# Altium schematic sheet Horloge_Counter.SchDoc
size A4
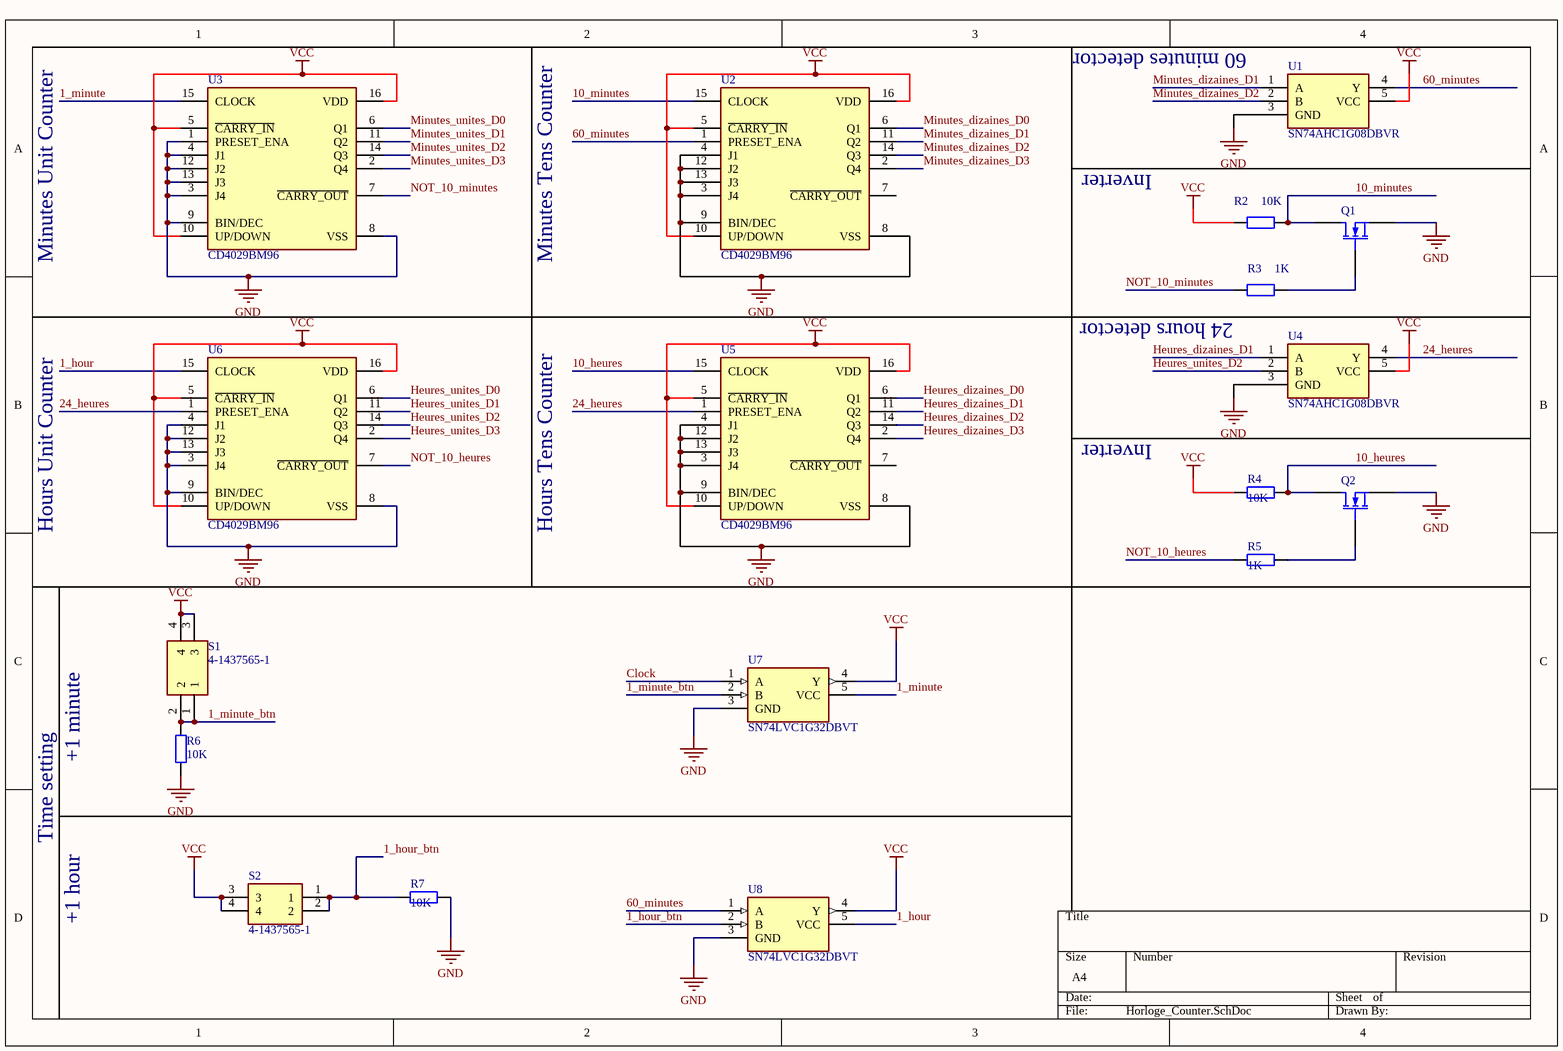
[diagram p0: Horloge_Counter.SchDoc]

## Parts
Q1  MOSFET-N  [SOT23_M]  (value not drawn)
Q2  MOSFET-N  [SOT23_M]  (value not drawn)
R2  value 10K  [Resistor 1206]  (hidden comment: Res2)
R3  value 1K  [Resistor 1206]  (hidden comment: Res2)
R4  value 10K  [Resistor 1206]  (hidden comment: Res2)
R5  value 1K  [Resistor 1206]  (hidden comment: Res2)
R6  value 10K  [Resistor 1206]  (hidden comment: Res2)
R7  value 10K  [Resistor 1206]  (hidden comment: Res2)
S1  4-1437565-1  [FSM-SWITCH]
S2  4-1437565-1  [FSM-SWITCH]
U1  SN74AHC1G08DBVR  [SOT95P280X145-5N]
U2  CD4029BM96  [SOIC127P600X175-16N]
U3  CD4029BM96  [SOIC127P600X175-16N]
U4  SN74AHC1G08DBVR  [SOT95P280X145-5N]
U5  CD4029BM96  [SOIC127P600X175-16N]
U6  CD4029BM96  [SOIC127P600X175-16N]
U7  SN74LVC1G32DBVT  [SOT95P280X145-5N]
U8  SN74LVC1G32DBVT  [SOT95P280X145-5N]

## Nets
GND: Q1.3(S) Q2.3(S) R6.1 R7.2 U1.3(GND) U2.3(J4) U2.4(J1) U2.8(VSS) U2.9(BIN/DEC) U2.12(J2) U2.13(J3) U3.1(PRESET_ENA) U3.3(J4) U3.4(J1) U3.8(VSS) U3.9(BIN/DEC) U3.12(J2) U3.13(J3) U4.3(GND) U5.3(J4) U5.4(J1) U5.8(VSS) U5.9(BIN/DEC) U5.12(J2) U5.13(J3) U6.3(J4) U6.4(J1) U6.8(VSS) U6.9(BIN/DEC) U6.12(J2) U6.13(J3) U7.3(GND) U8.3(GND)
VCC: R2.1 R4.1 S1.3 S1.4 S2.3 S2.4 U1.5(VCC) U2.5(~{CARRY_IN}) U2.10(UP/DOWN) U2.16(VDD) U3.5(~{CARRY_IN}) U3.10(UP/DOWN) U3.16(VDD) U4.5(VCC) U5.5(~{CARRY_IN}) U5.10(UP/DOWN) U5.16(VDD) U6.5(~{CARRY_IN}) U6.10(UP/DOWN) U6.16(VDD) U7.4(Y) U8.4(Y)
1_hour: U6.15(CLOCK) U8.5(VCC)
1_hour_btn: R7.1 S2.1 S2.2 U8.2(B)
1_minute: U3.15(CLOCK) U7.5(VCC)
1_minute_btn: R6.2 S1.1 S1.2 U7.2(B)
10_heures: Q2.1(D) R4.2 U5.15(CLOCK)
10_minutes: Q1.1(D) R2.2 U2.15(CLOCK)
24_heures: U4.4(Y) U5.1(PRESET_ENA) U6.1(PRESET_ENA)
60_minutes: U1.4(Y) U2.1(PRESET_ENA) U8.1(A)
Clock: U7.1(A)
Heures_dizaines_D0: U5.6(Q1)
Heures_dizaines_D1: U4.1(A) U5.11(Q2)
Heures_dizaines_D2: U5.14(Q3)
Heures_dizaines_D3: U5.2(Q4)
Heures_unites_D0: U6.6(Q1)
Heures_unites_D1: U6.11(Q2)
Heures_unites_D2: U4.2(B) U6.14(Q3)
Heures_unites_D3: U6.2(Q4)
Minutes_dizaines_D0: U2.6(Q1)
Minutes_dizaines_D1: U1.1(A) U2.11(Q2)
Minutes_dizaines_D2: U1.2(B) U2.14(Q3)
Minutes_dizaines_D3: U2.2(Q4)
Minutes_unites_D0: U3.6(Q1)
Minutes_unites_D1: U3.11(Q2)
Minutes_unites_D2: U3.14(Q3)
Minutes_unites_D3: U3.2(Q4)
NOT_10_heures: R5.2 U6.7(~{CARRY_OUT})
NOT_10_minutes: R3.2 U3.7(~{CARRY_OUT})
NetQ1_2: Q1.2(G) R3.1
NetQ2_2: Q2.2(G) R5.1

Not connected (* = marked no-connect by the designer): U2 7(~{CARRY_OUT}); U5 7(~{CARRY_OUT})

## Notes on the sheet
- (near U1) 60 minutes detector
- Inverter
- Minutes Unit Counter
- Minutes Tens Counter
- (near R3) 24 hours detector
- Hours Unit Counter
- Hours Tens Counter
- +1 minute
- Time setting
- +1 hour

## Library data of the parts
Q1 Q2 = MOSFET-N: N-Channel MOSFET; pin to pad: 2>3 3>2; Published: 8-Jun-2000; LatestRevisionDate: 17-Jul-2002; LatestRevisionNote: Re-released for DXP Platform.; PackageVersion: 1995/1996; PackageReference: E3; Publisher: Altium Limited; PackageDescription: TO, Flat Index; 3 In-Line, Axial Leads; Body Dia. 4.6mm; Lead Dia. 0.5 mm (max)
R2-R7 = Res2: Resistor; Published: 8-Jun-2000; LatestRevisionDate: 17-Jul-2002; LatestRevisionNote: Re-released for DXP Platform.; PackageReference: AXIAL-0.4; Publisher: Altium Limited; PackageDescription: Axial Device, Thru-Hole; 2 Leads; 0.4 in Pin Spacing
S1 S2 = 4-1437565-1: Switch; Manufacturer_Name: TE Connectivity; Datasheet Link: http://docs-emea.rs-online.com/webdocs/14a3/0900766b814a3369.pdf; Manufacturer_Part_Number: 4-1437565-1; Arrow Part Number: 4-1437565-1; Arrow Price/Stock: https://www.arrow.com/en/products/4-1437565-1/te-connectivity; Mouser Part Number: N/A; Mouser Price/Stock: https://www.mouser.com/Search/Refine.aspx?Keyword=N%2FA
U1 U4 = SN74AHC1G08DBVR: Undefined or Miscellaneous; Manufacturer_Name: Texas Instruments; Datasheet Link: http://www.ti.com/general/docs/lit/getliterature.tsp?genericPartNumber=SN74AHC1G08&&fileType=pdf; Height: 1.45mm; Manufacturer_Part_Number: SN74AHC1G08DBVR; Arrow Part Number: SN74AHC1G08DBVR; Arrow Price/Stock: https://www.arrow.com/en/products/sn74ahc1g08dbvr/texas-instruments; Mouser Part Number: 595-SN74AHC1G08DBVR; Mouser Price/Stock: https://www.mouser.co.uk/ProductDetail/Texas-Instruments/SN74AHC1G08DBVR?qs=tJ5HNKWh3OXzGHgsEkuHbw%3D%3D
U2 U3 U5 U6 = CD4029BM96: Integrated Circuit; Manufacturer_Name: Texas Instruments; Datasheet Link: http://www.ti.com/lit/gpn/cd4029b; Height: 1.75mm; Manufacturer_Part_Number: CD4029BM96; Arrow Part Number: CD4029BM96; Arrow Price/Stock: https://www.arrow.com/en/products/cd4029bm96/texas-instruments; Mouser Part Number: 595-CD4029BM96; Mouser Price/Stock: https://www.mouser.co.uk/ProductDetail/Texas-Instruments/CD4029BM96?qs=LU5rZWrBGo0isl%252BErG%2F5MQ%3D%3D
U7 U8 = SN74LVC1G32DBVT: Integrated Circuit; Manufacturer_Name: Texas Instruments; Datasheet Link: http://www.ti.com/lit/ds/symlink/sn74lvc1g32.pdf; Height: 1.45mm; Manufacturer_Part_Number: SN74LVC1G32DBVT; Arrow Part Number: SN74LVC1G32DBVT; Arrow Price/Stock: https://www.arrow.com/en/products/sn74lvc1g32dbvt/texas-instruments; Mouser Part Number: 595-SN74LVC1G32DBVT; Mouser Price/Stock: https://www.mouser.co.uk/ProductDetail/Texas-Instruments/SN74LVC1G32DBVT?qs=3pnr37ZAbK8uO%252Bsik6I8Zw%3D%3D